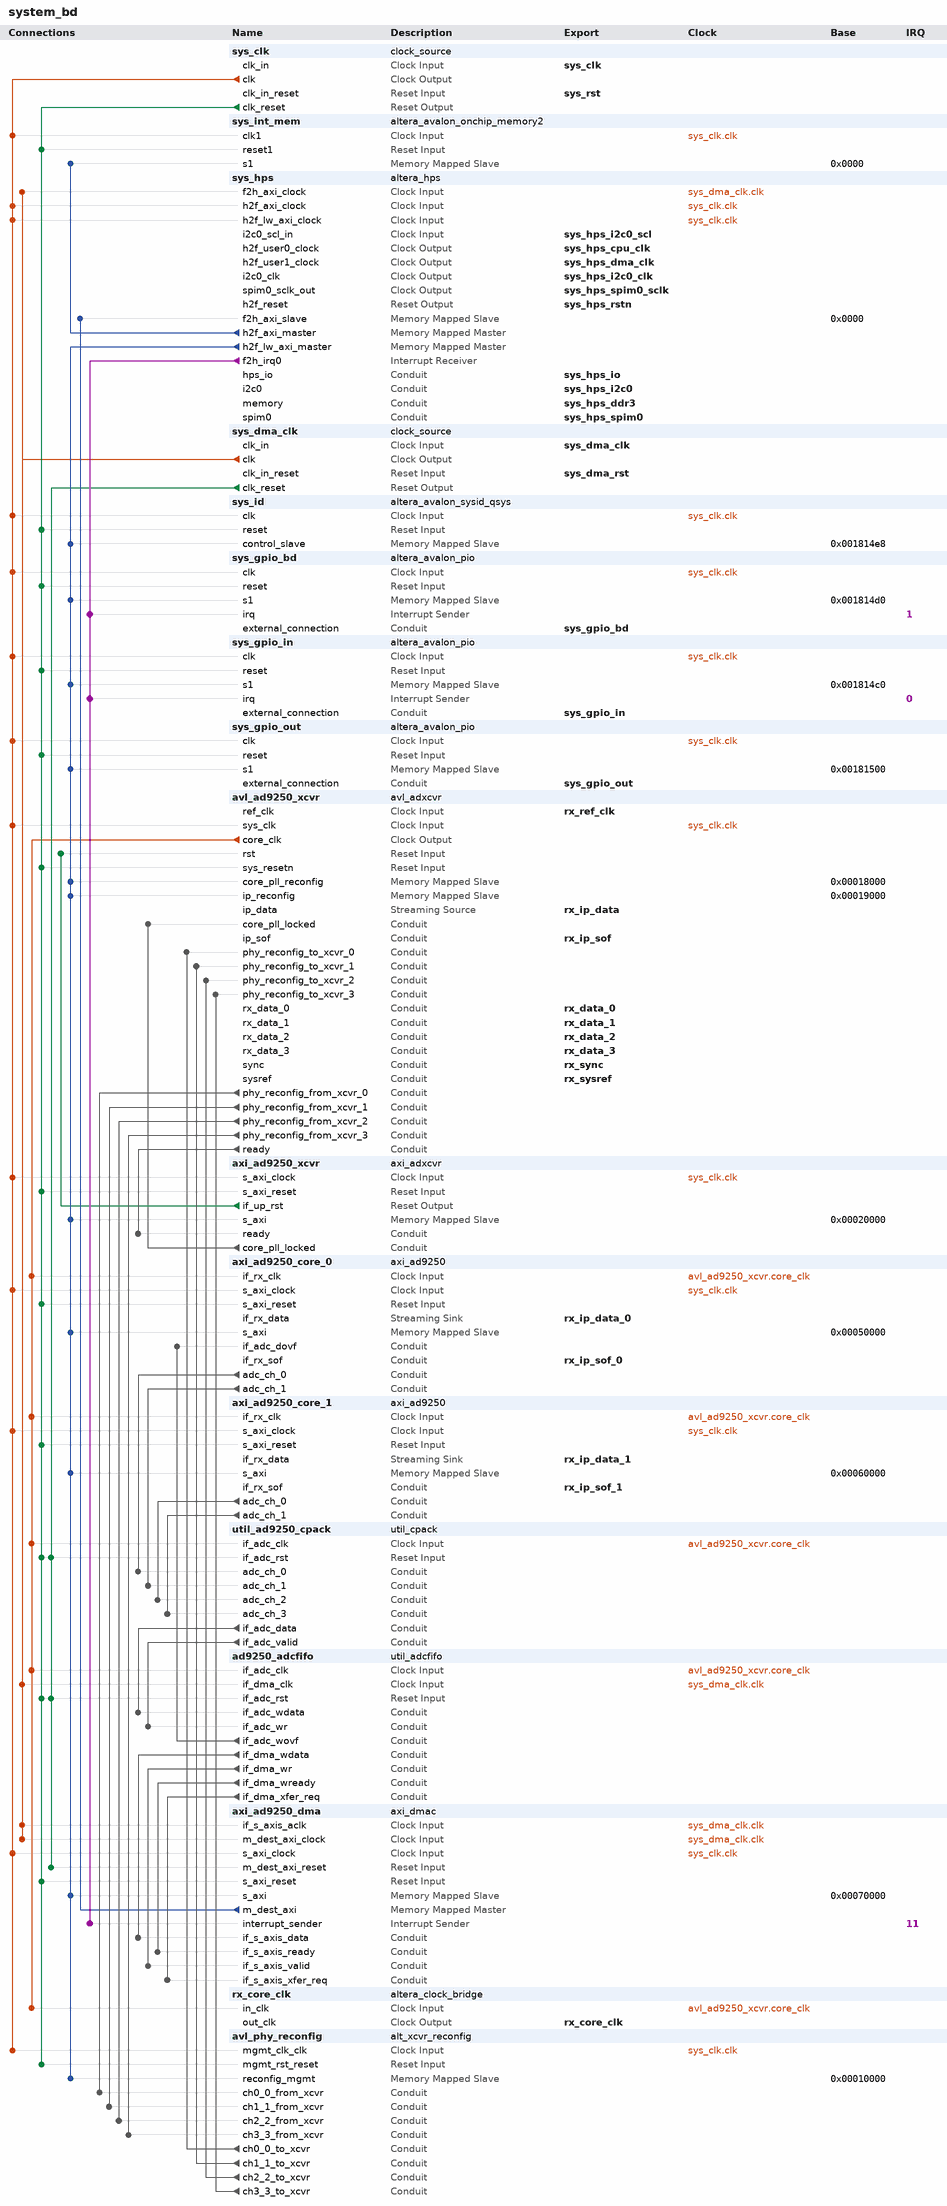
[diagram p0: system contents]
# Platform Designer (Qsys) system system_bd, Arria V 5ASTFD5K3F40I3ES
# Parameters at their usual value, and those the tool derives, are not listed.
package require -exact qsys 16.0
create_system system_bd
set_project_property DEVICE_FAMILY {Arria V}
set_project_property DEVICE 5ASTFD5K3F40I3ES

add_instance sys_clk clock_source 16.0
set_instance_parameter_value sys_clk clockFrequency 100000000
set_instance_parameter_value sys_clk resetSynchronousEdges DEASSERT

add_instance sys_int_mem altera_avalon_onchip_memory2 16.0
set_instance_parameter_value sys_int_mem dataWidth 64
set_instance_parameter_value sys_int_mem dualPort false
set_instance_parameter_value sys_int_mem initMemContent false
set_instance_parameter_value sys_int_mem initializationFileName onchip_mem.hex
set_instance_parameter_value sys_int_mem memorySize 65536

add_instance sys_hps altera_hps 16.0
set_instance_parameter_value sys_hps EMAC1_Mode RGMII
set_instance_parameter_value sys_hps EMAC1_PinMuxing {HPS I/O Set 0}
set_instance_parameter_value sys_hps F2SCLK_COLDRST_Enable false
set_instance_parameter_value sys_hps F2SCLK_DBGRST_Enable false
set_instance_parameter_value sys_hps F2SCLK_WARMRST_Enable false
set_instance_parameter_value sys_hps F2SINTERRUPT_Enable true
set_instance_parameter_value sys_hps F2S_Width 2
set_instance_parameter_value sys_hps FPGA_PERIPHERAL_OUTPUT_CLOCK_FREQ_EMAC0_GTX_CLK 125
set_instance_parameter_value sys_hps FPGA_PERIPHERAL_OUTPUT_CLOCK_FREQ_EMAC0_MD_CLK 2.5
set_instance_parameter_value sys_hps FPGA_PERIPHERAL_OUTPUT_CLOCK_FREQ_EMAC1_GTX_CLK 125
set_instance_parameter_value sys_hps FPGA_PERIPHERAL_OUTPUT_CLOCK_FREQ_EMAC1_MD_CLK 2.5
set_instance_parameter_value sys_hps HPS_PROTOCOL DDR3
set_instance_parameter_value sys_hps I2C0_Mode Full
set_instance_parameter_value sys_hps I2C0_PinMuxing FPGA
set_instance_parameter_value sys_hps I2C1_Mode N/A
set_instance_parameter_value sys_hps I2C1_PinMuxing Unused
set_instance_parameter_value sys_hps LWH2F_Enable true
set_instance_parameter_value sys_hps MEM_BANKADDR_WIDTH 3
set_instance_parameter_value sys_hps MEM_CLK_FREQ 400.0
set_instance_parameter_value sys_hps MEM_COL_ADDR_WIDTH 10
set_instance_parameter_value sys_hps MEM_DQ_WIDTH 40
set_instance_parameter_value sys_hps MEM_DRV_STR RZQ/6
set_instance_parameter_value sys_hps MEM_ROW_ADDR_WIDTH 15
set_instance_parameter_value sys_hps MEM_RTT_NOM RZQ/4
set_instance_parameter_value sys_hps MEM_RTT_WR {Dynamic ODT off}
set_instance_parameter_value sys_hps MEM_TCL 7
set_instance_parameter_value sys_hps MEM_TFAW_NS 35.0
set_instance_parameter_value sys_hps MEM_TRAS_NS 35.0
set_instance_parameter_value sys_hps MEM_TRCD_NS 13.75
set_instance_parameter_value sys_hps MEM_TRFC_NS 260.0
set_instance_parameter_value sys_hps MEM_TRP_NS 13.75
set_instance_parameter_value sys_hps MEM_TRRD_NS 6.0
set_instance_parameter_value sys_hps MEM_VENDOR JEDEC
set_instance_parameter_value sys_hps MEM_WTCL 6
set_instance_parameter_value sys_hps QSPI_Mode {1 SS}
set_instance_parameter_value sys_hps QSPI_PinMuxing {HPS I/O Set 0}
set_instance_parameter_value sys_hps REF_CLK_FREQ 25.0
set_instance_parameter_value sys_hps S2FCLK_USER0CLK_Enable true
set_instance_parameter_value sys_hps S2FCLK_USER1CLK_Enable true
set_instance_parameter_value sys_hps S2FCLK_USER2CLK 5
set_instance_parameter_value sys_hps S2F_Width 2
set_instance_parameter_value sys_hps SDIO_Mode {4-bit Data}
set_instance_parameter_value sys_hps SDIO_PinMuxing {HPS I/O Set 0}
set_instance_parameter_value sys_hps SPIM0_Mode Full
set_instance_parameter_value sys_hps SPIM0_PinMuxing FPGA
set_instance_parameter_value sys_hps SPIM1_Mode N/A
set_instance_parameter_value sys_hps SPIM1_PinMuxing Unused
set_instance_parameter_value sys_hps STM_Enable false
set_instance_parameter_value sys_hps TIMING_BOARD_AC_SKEW 0.02
set_instance_parameter_value sys_hps TIMING_BOARD_AC_TO_CK_SKEW 0.0
set_instance_parameter_value sys_hps TIMING_BOARD_DQ_TO_DQS_SKEW 0.0
set_instance_parameter_value sys_hps TIMING_BOARD_MAX_CK_DELAY 0.6
set_instance_parameter_value sys_hps TIMING_BOARD_MAX_DQS_DELAY 0.6
set_instance_parameter_value sys_hps TIMING_BOARD_SKEW_BETWEEN_DQS 0.02
set_instance_parameter_value sys_hps TIMING_BOARD_SKEW_CKDQS_DIMM_MAX 0.01
set_instance_parameter_value sys_hps TIMING_BOARD_SKEW_CKDQS_DIMM_MIN -0.01
set_instance_parameter_value sys_hps TIMING_BOARD_SKEW_WITHIN_DQS 0.02
set_instance_parameter_value sys_hps TIMING_TDH 45
set_instance_parameter_value sys_hps TIMING_TDQSCK 225
set_instance_parameter_value sys_hps TIMING_TDQSQ 100
set_instance_parameter_value sys_hps TIMING_TDQSS 0.27
set_instance_parameter_value sys_hps TIMING_TDS 10
set_instance_parameter_value sys_hps TIMING_TDSH 0.18
set_instance_parameter_value sys_hps TIMING_TDSS 0.18
set_instance_parameter_value sys_hps TIMING_TIH 120
set_instance_parameter_value sys_hps TIMING_TIS 170
set_instance_parameter_value sys_hps TIMING_TQSH 0.4
set_instance_parameter_value sys_hps UART0_Mode {No Flow Control}
set_instance_parameter_value sys_hps UART0_PinMuxing {HPS I/O Set 1}
set_instance_parameter_value sys_hps USB1_Mode SDR
set_instance_parameter_value sys_hps USB1_PinMuxing {HPS I/O Set 0}
set_instance_parameter_value sys_hps desired_cfg_clk_mhz 50.0
set_instance_parameter_value sys_hps desired_qspi_clk_mhz 400.0
set_instance_parameter_value sys_hps use_default_mpu_clk false

add_instance sys_dma_clk clock_source 16.0
set_instance_parameter_value sys_dma_clk clockFrequency 100000000
set_instance_parameter_value sys_dma_clk resetSynchronousEdges DEASSERT

add_instance sys_id altera_avalon_sysid_qsys 16.0
set_instance_parameter_value sys_id id 182193580

add_instance sys_gpio_bd altera_avalon_pio 16.0
set_instance_parameter_value sys_gpio_bd direction InOut
set_instance_parameter_value sys_gpio_bd generateIRQ true
set_instance_parameter_value sys_gpio_bd width 32

add_instance sys_gpio_in altera_avalon_pio 16.0
set_instance_parameter_value sys_gpio_in direction Input
set_instance_parameter_value sys_gpio_in generateIRQ true
set_instance_parameter_value sys_gpio_in width 32

add_instance sys_gpio_out altera_avalon_pio 16.0
set_instance_parameter_value sys_gpio_out direction Output
set_instance_parameter_value sys_gpio_out width 32

add_instance avl_ad9250_xcvr avl_adxcvr 1.0
set_instance_parameter_value avl_ad9250_xcvr CORECLK_FREQUENCY 125.0
set_instance_parameter_value avl_ad9250_xcvr FRM_BCNT 4
set_instance_parameter_value avl_ad9250_xcvr FRM_SCNT 1
set_instance_parameter_value avl_ad9250_xcvr HD 0
set_instance_parameter_value avl_ad9250_xcvr ID 1
set_instance_parameter_value avl_ad9250_xcvr LANE_RATE 5000.0
set_instance_parameter_value avl_ad9250_xcvr MF_FCNT 32
set_instance_parameter_value avl_ad9250_xcvr NUM_OF_CONVS 4
set_instance_parameter_value avl_ad9250_xcvr NUM_OF_LANES 4
set_instance_parameter_value avl_ad9250_xcvr PCS_CONFIG JESD_PCS_CFG1
set_instance_parameter_value avl_ad9250_xcvr PLLCLK_FREQUENCY 2500.0
set_instance_parameter_value avl_ad9250_xcvr REFCLK_FREQUENCY 250.0
set_instance_parameter_value avl_ad9250_xcvr SYSCLK_FREQUENCY 50.0
set_instance_parameter_value avl_ad9250_xcvr TX_OR_RX_N 0

add_instance axi_ad9250_xcvr axi_adxcvr 1.0
set_instance_parameter_value axi_ad9250_xcvr ID 1
set_instance_parameter_value axi_ad9250_xcvr NUM_OF_LANES 4
set_instance_parameter_value axi_ad9250_xcvr TX_OR_RX_N 0

add_instance axi_ad9250_core_0 axi_ad9250 1.0
set_instance_parameter_value axi_ad9250_core_0 DEVICE_TYPE 1
set_instance_parameter_value axi_ad9250_core_0 ID 0

add_instance axi_ad9250_core_1 axi_ad9250 1.0
set_instance_parameter_value axi_ad9250_core_1 DEVICE_TYPE 1
set_instance_parameter_value axi_ad9250_core_1 ID 0

add_instance util_ad9250_cpack util_cpack 1.0
set_instance_parameter_value util_ad9250_cpack CHANNEL_DATA_WIDTH 32
set_instance_parameter_value util_ad9250_cpack NUM_OF_CHANNELS 4

add_instance ad9250_adcfifo util_adcfifo 1.0
set_instance_parameter_value ad9250_adcfifo ADC_DATA_WIDTH 128
set_instance_parameter_value ad9250_adcfifo DMA_ADDRESS_WIDTH 16
set_instance_parameter_value ad9250_adcfifo DMA_DATA_WIDTH 128
set_instance_parameter_value ad9250_adcfifo DMA_READY_ENABLE 1

add_instance axi_ad9250_dma axi_dmac 1.0
set_instance_parameter_value axi_ad9250_dma ASYNC_CLK_DEST_REQ 1
set_instance_parameter_value axi_ad9250_dma ASYNC_CLK_REQ_SRC 1
set_instance_parameter_value axi_ad9250_dma ASYNC_CLK_SRC_DEST 1
set_instance_parameter_value axi_ad9250_dma AXI_SLICE_DEST 0
set_instance_parameter_value axi_ad9250_dma AXI_SLICE_SRC 0
set_instance_parameter_value axi_ad9250_dma CYCLIC 0
set_instance_parameter_value axi_ad9250_dma DMA_2D_TRANSFER 0
set_instance_parameter_value axi_ad9250_dma DMA_DATA_WIDTH_DEST 128
set_instance_parameter_value axi_ad9250_dma DMA_DATA_WIDTH_SRC 128
set_instance_parameter_value axi_ad9250_dma DMA_LENGTH_WIDTH 24
set_instance_parameter_value axi_ad9250_dma DMA_TYPE_DEST 0
set_instance_parameter_value axi_ad9250_dma DMA_TYPE_SRC 1
set_instance_parameter_value axi_ad9250_dma FIFO_SIZE 4
set_instance_parameter_value axi_ad9250_dma ID 0
set_instance_parameter_value axi_ad9250_dma SYNC_TRANSFER_START 1

add_instance rx_core_clk altera_clock_bridge 16.0
set_instance_parameter_value rx_core_clk DERIVED_CLOCK_RATE 125
set_instance_parameter_value rx_core_clk EXPLICIT_CLOCK_RATE 0

add_instance avl_phy_reconfig alt_xcvr_reconfig 16.0
set_instance_parameter_value avl_phy_reconfig device_family {Arria V}
set_instance_parameter_value avl_phy_reconfig enable_adce 0
set_instance_parameter_value avl_phy_reconfig enable_analog 1
set_instance_parameter_value avl_phy_reconfig gui_split_sizes 1,1,1,1
set_instance_parameter_value avl_phy_reconfig number_of_reconfig_interfaces 4

# connections
add_connection avl_ad9250_xcvr.core_clk ad9250_adcfifo.if_adc_clk clock
add_connection avl_ad9250_xcvr.core_clk axi_ad9250_core_0.if_rx_clk clock
add_connection avl_ad9250_xcvr.core_clk axi_ad9250_core_1.if_rx_clk clock
add_connection avl_ad9250_xcvr.core_clk rx_core_clk.in_clk clock
add_connection avl_ad9250_xcvr.core_clk util_ad9250_cpack.if_adc_clk clock
add_connection sys_clk.clk avl_ad9250_xcvr.sys_clk clock
add_connection sys_clk.clk avl_phy_reconfig.mgmt_clk_clk clock
add_connection sys_clk.clk axi_ad9250_core_0.s_axi_clock clock
add_connection sys_clk.clk axi_ad9250_core_1.s_axi_clock clock
add_connection sys_clk.clk axi_ad9250_dma.s_axi_clock clock
add_connection sys_clk.clk axi_ad9250_xcvr.s_axi_clock clock
add_connection sys_clk.clk sys_gpio_bd.clk clock
add_connection sys_clk.clk sys_gpio_in.clk clock
add_connection sys_clk.clk sys_gpio_out.clk clock
add_connection sys_clk.clk sys_hps.h2f_axi_clock clock
add_connection sys_clk.clk sys_hps.h2f_lw_axi_clock clock
add_connection sys_clk.clk sys_id.clk clock
add_connection sys_clk.clk sys_int_mem.clk1 clock
add_connection sys_dma_clk.clk ad9250_adcfifo.if_dma_clk clock
add_connection sys_dma_clk.clk axi_ad9250_dma.if_s_axis_aclk clock
add_connection sys_dma_clk.clk axi_ad9250_dma.m_dest_axi_clock clock
add_connection sys_dma_clk.clk sys_hps.f2h_axi_clock clock
add_connection axi_ad9250_xcvr.if_up_rst avl_ad9250_xcvr.rst reset
add_connection sys_clk.clk_reset ad9250_adcfifo.if_adc_rst reset
add_connection sys_clk.clk_reset avl_ad9250_xcvr.sys_resetn reset
add_connection sys_clk.clk_reset avl_phy_reconfig.mgmt_rst_reset reset
add_connection sys_clk.clk_reset axi_ad9250_core_0.s_axi_reset reset
add_connection sys_clk.clk_reset axi_ad9250_core_1.s_axi_reset reset
add_connection sys_clk.clk_reset axi_ad9250_dma.s_axi_reset reset
add_connection sys_clk.clk_reset axi_ad9250_xcvr.s_axi_reset reset
add_connection sys_clk.clk_reset sys_gpio_bd.reset reset
add_connection sys_clk.clk_reset sys_gpio_in.reset reset
add_connection sys_clk.clk_reset sys_gpio_out.reset reset
add_connection sys_clk.clk_reset sys_id.reset reset
add_connection sys_clk.clk_reset sys_int_mem.reset1 reset
add_connection sys_clk.clk_reset util_ad9250_cpack.if_adc_rst reset
add_connection sys_dma_clk.clk_reset ad9250_adcfifo.if_adc_rst reset
add_connection sys_dma_clk.clk_reset axi_ad9250_dma.m_dest_axi_reset reset
add_connection sys_dma_clk.clk_reset util_ad9250_cpack.if_adc_rst reset
add_connection axi_ad9250_dma.m_dest_axi sys_hps.f2h_axi_slave avalon
set_connection_parameter_value axi_ad9250_dma.m_dest_axi/sys_hps.f2h_axi_slave baseAddress 0x0000
add_connection sys_hps.h2f_axi_master sys_int_mem.s1 avalon
set_connection_parameter_value sys_hps.h2f_axi_master/sys_int_mem.s1 baseAddress 0x0000
add_connection sys_hps.h2f_lw_axi_master avl_ad9250_xcvr.core_pll_reconfig avalon
set_connection_parameter_value sys_hps.h2f_lw_axi_master/avl_ad9250_xcvr.core_pll_reconfig baseAddress 0x00018000
add_connection sys_hps.h2f_lw_axi_master avl_ad9250_xcvr.ip_reconfig avalon
set_connection_parameter_value sys_hps.h2f_lw_axi_master/avl_ad9250_xcvr.ip_reconfig baseAddress 0x00019000
add_connection sys_hps.h2f_lw_axi_master avl_phy_reconfig.reconfig_mgmt avalon
set_connection_parameter_value sys_hps.h2f_lw_axi_master/avl_phy_reconfig.reconfig_mgmt baseAddress 0x00010000
add_connection sys_hps.h2f_lw_axi_master axi_ad9250_core_0.s_axi avalon
set_connection_parameter_value sys_hps.h2f_lw_axi_master/axi_ad9250_core_0.s_axi baseAddress 0x00050000
add_connection sys_hps.h2f_lw_axi_master axi_ad9250_core_1.s_axi avalon
set_connection_parameter_value sys_hps.h2f_lw_axi_master/axi_ad9250_core_1.s_axi baseAddress 0x00060000
add_connection sys_hps.h2f_lw_axi_master axi_ad9250_dma.s_axi avalon
set_connection_parameter_value sys_hps.h2f_lw_axi_master/axi_ad9250_dma.s_axi baseAddress 0x00070000
add_connection sys_hps.h2f_lw_axi_master axi_ad9250_xcvr.s_axi avalon
set_connection_parameter_value sys_hps.h2f_lw_axi_master/axi_ad9250_xcvr.s_axi baseAddress 0x00020000
add_connection sys_hps.h2f_lw_axi_master sys_gpio_bd.s1 avalon
set_connection_parameter_value sys_hps.h2f_lw_axi_master/sys_gpio_bd.s1 baseAddress 0x001814d0
add_connection sys_hps.h2f_lw_axi_master sys_gpio_in.s1 avalon
set_connection_parameter_value sys_hps.h2f_lw_axi_master/sys_gpio_in.s1 baseAddress 0x001814c0
add_connection sys_hps.h2f_lw_axi_master sys_gpio_out.s1 avalon
set_connection_parameter_value sys_hps.h2f_lw_axi_master/sys_gpio_out.s1 baseAddress 0x00181500
add_connection sys_hps.h2f_lw_axi_master sys_id.control_slave avalon
set_connection_parameter_value sys_hps.h2f_lw_axi_master/sys_id.control_slave baseAddress 0x001814e8
add_connection ad9250_adcfifo.if_adc_wovf axi_ad9250_core_0.if_adc_dovf conduit
add_connection ad9250_adcfifo.if_dma_wdata axi_ad9250_dma.if_s_axis_data conduit
add_connection ad9250_adcfifo.if_dma_wr axi_ad9250_dma.if_s_axis_valid conduit
add_connection ad9250_adcfifo.if_dma_wready axi_ad9250_dma.if_s_axis_ready conduit
add_connection ad9250_adcfifo.if_dma_xfer_req axi_ad9250_dma.if_s_axis_xfer_req conduit
add_connection avl_ad9250_xcvr.phy_reconfig_from_xcvr_0 avl_phy_reconfig.ch0_0_from_xcvr conduit
add_connection avl_ad9250_xcvr.phy_reconfig_from_xcvr_1 avl_phy_reconfig.ch1_1_from_xcvr conduit
add_connection avl_ad9250_xcvr.phy_reconfig_from_xcvr_2 avl_phy_reconfig.ch2_2_from_xcvr conduit
add_connection avl_ad9250_xcvr.phy_reconfig_from_xcvr_3 avl_phy_reconfig.ch3_3_from_xcvr conduit
add_connection avl_ad9250_xcvr.ready axi_ad9250_xcvr.ready conduit
add_connection avl_phy_reconfig.ch0_0_to_xcvr avl_ad9250_xcvr.phy_reconfig_to_xcvr_0 conduit
add_connection avl_phy_reconfig.ch1_1_to_xcvr avl_ad9250_xcvr.phy_reconfig_to_xcvr_1 conduit
add_connection avl_phy_reconfig.ch2_2_to_xcvr avl_ad9250_xcvr.phy_reconfig_to_xcvr_2 conduit
add_connection avl_phy_reconfig.ch3_3_to_xcvr avl_ad9250_xcvr.phy_reconfig_to_xcvr_3 conduit
add_connection axi_ad9250_core_0.adc_ch_0 util_ad9250_cpack.adc_ch_0 conduit
add_connection axi_ad9250_core_0.adc_ch_1 util_ad9250_cpack.adc_ch_1 conduit
add_connection axi_ad9250_core_1.adc_ch_0 util_ad9250_cpack.adc_ch_2 conduit
add_connection axi_ad9250_core_1.adc_ch_1 util_ad9250_cpack.adc_ch_3 conduit
add_connection axi_ad9250_xcvr.core_pll_locked avl_ad9250_xcvr.core_pll_locked conduit
add_connection util_ad9250_cpack.if_adc_data ad9250_adcfifo.if_adc_wdata conduit
add_connection util_ad9250_cpack.if_adc_valid ad9250_adcfifo.if_adc_wr conduit
add_connection sys_hps.f2h_irq0 axi_ad9250_dma.interrupt_sender interrupt
set_connection_parameter_value sys_hps.f2h_irq0/axi_ad9250_dma.interrupt_sender irqNumber 11
add_connection sys_hps.f2h_irq0 sys_gpio_bd.irq interrupt
set_connection_parameter_value sys_hps.f2h_irq0/sys_gpio_bd.irq irqNumber 1
add_connection sys_hps.f2h_irq0 sys_gpio_in.irq interrupt
set_connection_parameter_value sys_hps.f2h_irq0/sys_gpio_in.irq irqNumber 0

# exported interfaces
add_interface rx_core_clk clock source
set_interface_property rx_core_clk EXPORT_OF rx_core_clk.out_clk
add_interface rx_data_0 conduit end
set_interface_property rx_data_0 EXPORT_OF avl_ad9250_xcvr.rx_data_0
add_interface rx_data_1 conduit end
set_interface_property rx_data_1 EXPORT_OF avl_ad9250_xcvr.rx_data_1
add_interface rx_data_2 conduit end
set_interface_property rx_data_2 EXPORT_OF avl_ad9250_xcvr.rx_data_2
add_interface rx_data_3 conduit end
set_interface_property rx_data_3 EXPORT_OF avl_ad9250_xcvr.rx_data_3
add_interface rx_ip_data avalon_streaming source
set_interface_property rx_ip_data EXPORT_OF avl_ad9250_xcvr.ip_data
add_interface rx_ip_data_0 avalon_streaming sink
set_interface_property rx_ip_data_0 EXPORT_OF axi_ad9250_core_0.if_rx_data
add_interface rx_ip_data_1 avalon_streaming sink
set_interface_property rx_ip_data_1 EXPORT_OF axi_ad9250_core_1.if_rx_data
add_interface rx_ip_sof conduit end
set_interface_property rx_ip_sof EXPORT_OF avl_ad9250_xcvr.ip_sof
add_interface rx_ip_sof_0 conduit end
set_interface_property rx_ip_sof_0 EXPORT_OF axi_ad9250_core_0.if_rx_sof
add_interface rx_ip_sof_1 conduit end
set_interface_property rx_ip_sof_1 EXPORT_OF axi_ad9250_core_1.if_rx_sof
add_interface rx_ref_clk clock sink
set_interface_property rx_ref_clk EXPORT_OF avl_ad9250_xcvr.ref_clk
add_interface rx_sync conduit end
set_interface_property rx_sync EXPORT_OF avl_ad9250_xcvr.sync
add_interface rx_sysref conduit end
set_interface_property rx_sysref EXPORT_OF avl_ad9250_xcvr.sysref
add_interface sys_clk clock sink
set_interface_property sys_clk EXPORT_OF sys_clk.clk_in
add_interface sys_dma_clk clock sink
set_interface_property sys_dma_clk EXPORT_OF sys_dma_clk.clk_in
add_interface sys_dma_rst reset sink
set_interface_property sys_dma_rst EXPORT_OF sys_dma_clk.clk_in_reset
add_interface sys_gpio_bd conduit end
set_interface_property sys_gpio_bd EXPORT_OF sys_gpio_bd.external_connection
add_interface sys_gpio_in conduit end
set_interface_property sys_gpio_in EXPORT_OF sys_gpio_in.external_connection
add_interface sys_gpio_out conduit end
set_interface_property sys_gpio_out EXPORT_OF sys_gpio_out.external_connection
add_interface sys_hps_cpu_clk clock source
set_interface_property sys_hps_cpu_clk EXPORT_OF sys_hps.h2f_user0_clock
add_interface sys_hps_ddr3 conduit end
set_interface_property sys_hps_ddr3 EXPORT_OF sys_hps.memory
add_interface sys_hps_dma_clk clock source
set_interface_property sys_hps_dma_clk EXPORT_OF sys_hps.h2f_user1_clock
add_interface sys_hps_i2c0 conduit end
set_interface_property sys_hps_i2c0 EXPORT_OF sys_hps.i2c0
add_interface sys_hps_i2c0_clk clock source
set_interface_property sys_hps_i2c0_clk EXPORT_OF sys_hps.i2c0_clk
add_interface sys_hps_i2c0_scl clock sink
set_interface_property sys_hps_i2c0_scl EXPORT_OF sys_hps.i2c0_scl_in
add_interface sys_hps_io conduit end
set_interface_property sys_hps_io EXPORT_OF sys_hps.hps_io
add_interface sys_hps_rstn reset source
set_interface_property sys_hps_rstn EXPORT_OF sys_hps.h2f_reset
add_interface sys_hps_spim0 conduit end
set_interface_property sys_hps_spim0 EXPORT_OF sys_hps.spim0
add_interface sys_hps_spim0_sclk clock source
set_interface_property sys_hps_spim0_sclk EXPORT_OF sys_hps.spim0_sclk_out
add_interface sys_rst reset sink
set_interface_property sys_rst EXPORT_OF sys_clk.clk_in_reset

set_interconnect_requirement {$system} qsys_mm.clockCrossingAdapter HANDSHAKE
set_interconnect_requirement {$system} qsys_mm.maxAdditionalLatency 0

save_system system_bd.qsys
